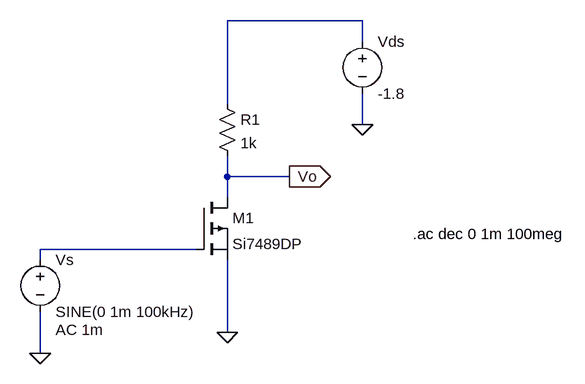
[diagram p0: schematic PMOS f.asc]
PMOS f.asc, the LTspice schematic file:
Version 4
SHEET 1 880 680
WIRE 352 0 144 0
WIRE 352 32 352 0
WIRE 144 128 144 0
WIRE 352 160 352 112
WIRE 144 240 144 208
WIRE 240 240 144 240
WIRE 144 272 144 240
WIRE 96 352 -144 352
WIRE -144 368 -144 352
WIRE 144 480 144 368
WIRE -144 512 -144 448
FLAG 352 160 0
FLAG 144 480 0
FLAG -144 512 0
FLAG 240 240 Vo
IOPIN 240 240 Out
SYMBOL res 128 112 R0
SYMATTR InstName R1
SYMATTR Value 1k
SYMBOL pmos 96 272 R0
SYMATTR InstName M1
SYMATTR Value Si7489DP
SYMBOL voltage 352 16 R0
WINDOW 123 0 0 Left 0
WINDOW 39 0 0 Left 0
SYMATTR InstName Vds
SYMATTR Value -1.8
SYMBOL voltage -144 352 R0
WINDOW 123 24 124 Left 2
WINDOW 39 0 0 Left 0
SYMATTR InstName Vs
SYMATTR Value SINE(0 1m 100kHz)
SYMATTR Value2 AC 1m
TEXT 430 328 Left 2 !.ac dec 0 1m 100meg

The netlist it stands for:
* PMOS f.asc
R1 N001 Vo 1k
M1 Vo N002 0 0 Si7489DP
Vds N001 0 -1.8
Vs N002 0 SINE(0 1m 100kHz) AC 1m
.model NMOS NMOS
.model PMOS PMOS
.lib standard.mos
.ac dec 0 1m 100meg
.backanno
.end